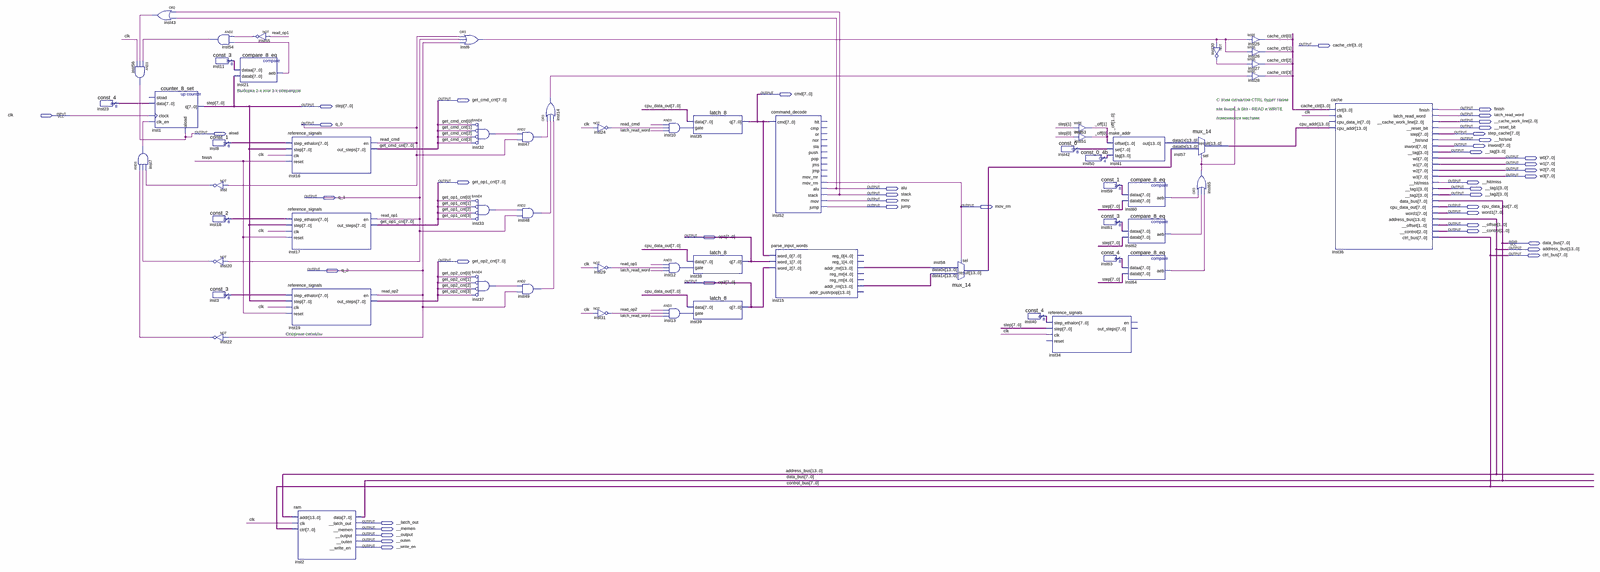
[diagram p0: schematic sheet, whole]
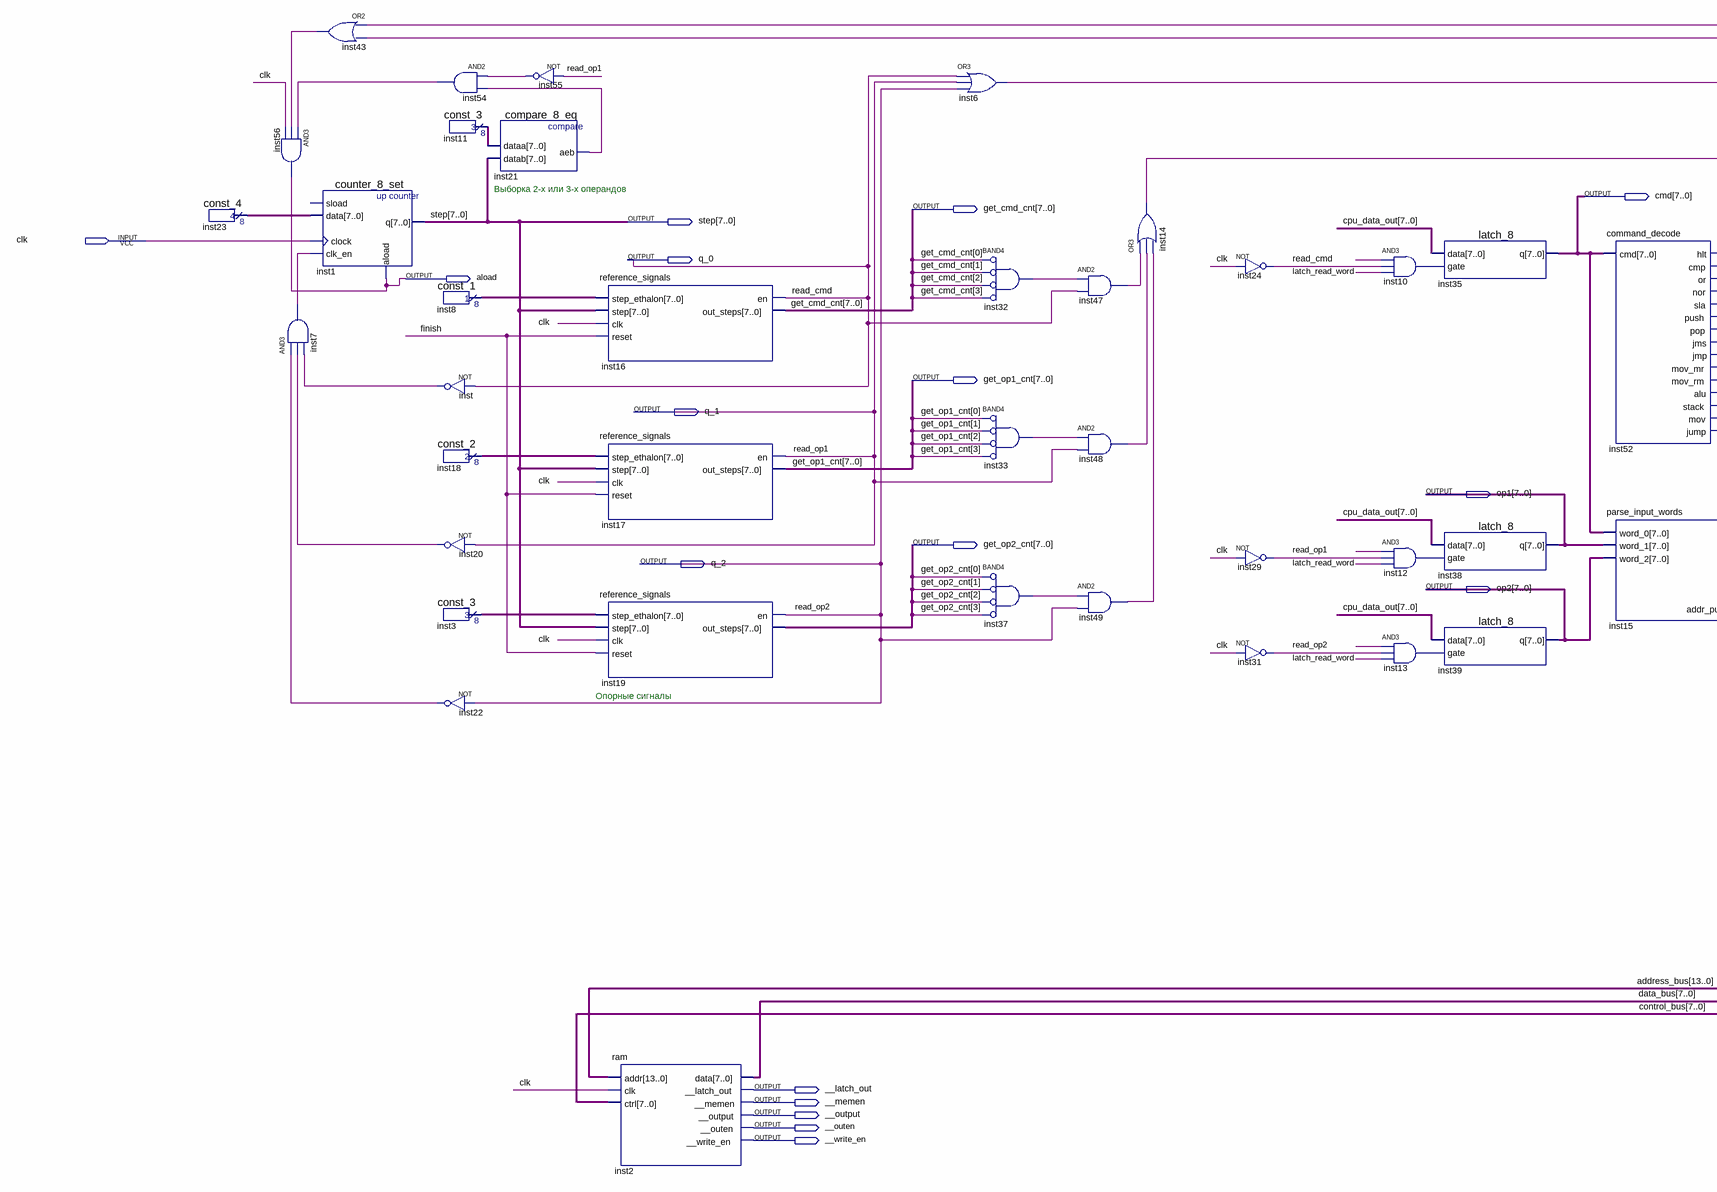
[diagram p1: schematic sheet, left part]
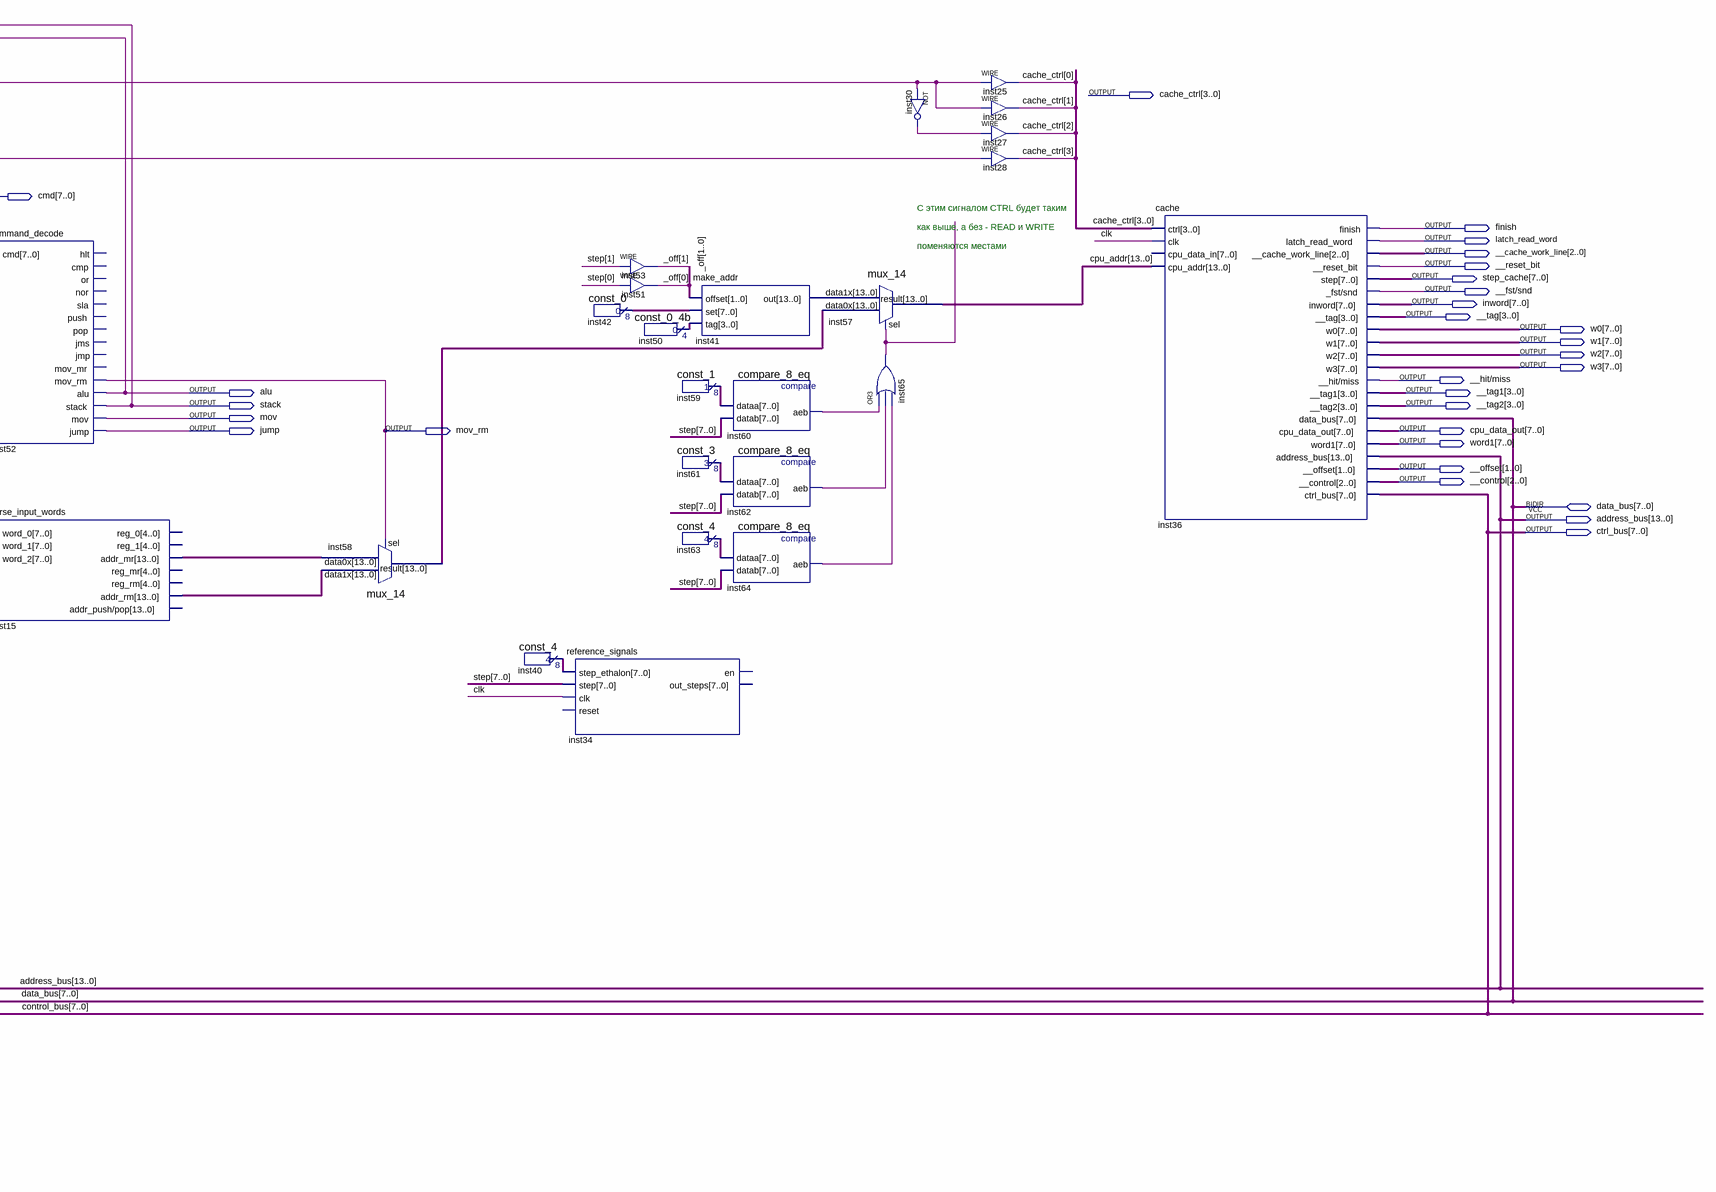
[diagram p2: schematic sheet, right part]
// Quartus schematic control_block.bdf as structural Verilog: 60 symbols, 45 pins
module control_block (
  input  clk,
  inout  [7:0] data_bus,
  output [3:0] cache_ctrl,
  output [7:0] cmd,
  output [7:0] get_cmd_cnt,
  output [7:0] step,
  output finish,
  output latch_read_word,
  output [2:0] __cache_work_line,
  output q_0,
  output __reset_bit,
  output aload,
  output [7:0] step_cache,
  output \__fst/snd ,
  output [7:0] inword,
  output [3:0] __tag,
  output [7:0] w0,
  output [7:0] w1,
  output [7:0] w2,
  output [7:0] w3,
  output [7:0] get_op1_cnt,
  output \__hit/miss ,
  output alu,
  output [3:0] __tag1,
  output stack,
  output [3:0] __tag2,
  output q_1,
  output mov,
  output jump,
  output mov_rm,
  output [7:0] cpu_data_out,
  output [7:0] word1,
  output [1:0] __offset,
  output [2:0] __control,
  output [7:0] op1,
  output [13:0] address_bus,
  output [7:0] ctrl_bus,
  output [7:0] get_op2_cnt,
  output q_2,
  output [7:0] op2,
  output __latch_out,
  output __memen,
  output __output,
  output __outen,
  output __write_en
);

  wire inst6_out, inst7_out, inst10_out, inst12_out, inst13_out, inst14_out, inst20_out, inst21_aeb,
       inst22_out, inst24_out, inst29_out, inst30_out, inst31_out, inst32_out, inst33_out, inst37_out,
       inst43_out, inst47_out, inst48_out, inst49_out, inst54_out, inst55_out, inst60_aeb, inst62_aeb,
       inst64_aeb, inst65_out, inst_out;
  wire [1:0] _off;
  wire [3:0] inst50_result;
  wire [7:0] inst3_result, inst8_result, inst11_result, inst18_result, inst23_result, inst40_result,
       inst42_result, inst59_result, inst61_result, inst63_result;
  wire [13:0] cpu_addr, inst15_addr_mr, inst15_addr_rm, inst41_out, inst58_result;

  const_4 inst23 (.result(inst23_result));
  and inst56 (aload, inst54_out, inst43_out, clk);
  or inst43 (inst43_out, stack, alu);
  counter_8_set inst1 (.data(inst23_result), .clock(clk), .clk_en(inst7_out), .aload(aload), .q(step));  // open: sload
  and inst7 (inst7_out, inst22_out, inst20_out, inst_out);
  and inst54 (inst54_out, inst55_out, inst21_aeb);
  const_3 inst11 (.result(inst11_result));
  const_1 inst8 (.result(inst8_result));
  not inst (inst_out, q_0);
  const_2 inst18 (.result(inst18_result));
  not inst20 (inst20_out, q_1);
  const_3 inst3 (.result(inst3_result));
  not inst22 (inst22_out, q_2);
  not inst55 (inst55_out, q_1);
  compare_8_eq inst21 (.dataa(inst11_result), .datab(step), .aeb(inst21_aeb));
  reference_signals inst16 (
    .step_ethalon(inst8_result), .step(step), .clk(clk), .reset(finish), .en(q_0), .out_steps(get_cmd_cnt));
  reference_signals inst17 (
    .step_ethalon(inst18_result), .step(step), .clk(clk), .reset(finish), .en(q_1), .out_steps(get_op1_cnt));
  reference_signals inst19 (
    .step_ethalon(inst3_result), .step(step), .clk(clk), .reset(finish), .en(q_2), .out_steps(get_op2_cnt));
  ram inst2 (
    .addr(address_bus), .clk(clk), .ctrl(ctrl_bus), .__latch_out(__latch_out), .__memen(__memen),
    .__output(__output), .__outen(__outen), .__write_en(__write_en), .data(data_bus));
  or inst6 (inst6_out, q_0, q_1, q_2);
  and inst32 (inst32_out, ~get_cmd_cnt[0], ~get_cmd_cnt[1], ~get_cmd_cnt[2], ~get_cmd_cnt[3]);  // BAND4
  and inst33 (inst33_out, ~get_op1_cnt[0], ~get_op1_cnt[1], ~get_op1_cnt[2], ~get_op1_cnt[3]);  // BAND4
  and inst37 (inst37_out, ~get_op2_cnt[0], ~get_op2_cnt[1], ~get_op2_cnt[2], ~get_op2_cnt[3]);  // BAND4
  and inst47 (inst47_out, inst32_out, q_0);
  and inst48 (inst48_out, inst33_out, q_1);
  and inst49 (inst49_out, inst37_out, q_2);
  or inst14 (inst14_out, inst47_out, inst48_out, inst49_out);
  not inst24 (inst24_out, clk);
  not inst29 (inst29_out, clk);
  not inst31 (inst31_out, clk);
  and inst10 (inst10_out, q_0, inst24_out, latch_read_word);
  and inst12 (inst12_out, q_1, inst29_out, latch_read_word);
  and inst13 (inst13_out, q_2, inst31_out, latch_read_word);
  latch_8 inst35 (.data(cpu_data_out), .gate(inst10_out), .q(cmd));
  latch_8 inst38 (.data(cpu_data_out), .gate(inst12_out), .q(op1));
  latch_8 inst39 (.data(cpu_data_out), .gate(inst13_out), .q(op2));
  command_decode inst52 (
    .cmd(cmd), .mov_rm(mov_rm), .alu(alu), .stack(stack), .mov(mov), .jump(jump));  // open: hlt, cmp, or, nor, sla, push, pop, jms, jmp, mov_mr
  parse_input_words inst15 (
    .word_0(cmd), .word_1(op1), .word_2(op2), .addr_mr(inst15_addr_mr), .addr_rm(inst15_addr_rm));  // open: reg_0, reg_1, reg_mr, reg_rm, addr_push/pop
  mux_14 inst58 (.data1x(inst15_addr_rm), .data0x(inst15_addr_mr), .sel(mov_rm), .result(inst58_result));
  const_4 inst40 (.result(inst40_result));
  const_0 inst42 (.result(inst42_result));
  reference_signals inst34 (.step_ethalon(inst40_result), .step(step), .clk(clk));  // open: reset, en, out_steps
  assign _off[1] = step[1];  // WIRE inst53
  assign _off[0] = step[0];  // WIRE inst51
  const_0_4b inst50 (.result(inst50_result));
  const_1 inst59 (.result(inst59_result));
  const_3 inst61 (.result(inst61_result));
  const_4 inst63 (.result(inst63_result));
  make_addr inst41 (.offset(_off), .set(inst42_result), .tag(inst50_result), .out(inst41_out));
  compare_8_eq inst60 (.dataa(inst59_result), .datab(step), .aeb(inst60_aeb));
  compare_8_eq inst62 (.dataa(inst61_result), .datab(step), .aeb(inst62_aeb));
  compare_8_eq inst64 (.dataa(inst63_result), .datab(step), .aeb(inst64_aeb));
  mux_14 inst57 (.data1x(inst41_out), .data0x(inst58_result), .sel(inst65_out), .result(cpu_addr));
  or inst65 (inst65_out, inst60_aeb, inst62_aeb, inst64_aeb);
  not inst30 (inst30_out, inst6_out);
  assign cache_ctrl[0] = inst6_out;  // WIRE inst25
  assign cache_ctrl[1] = inst6_out;  // WIRE inst26
  assign cache_ctrl[2] = inst30_out;  // WIRE inst27
  assign cache_ctrl[3] = inst14_out;  // WIRE inst28
  cache inst36 (
    .ctrl(cache_ctrl), .clk(clk), .cpu_addr(cpu_addr), .finish(finish), .latch_read_word(latch_read_word),
    .__cache_work_line(__cache_work_line), .__reset_bit(__reset_bit), .step(step_cache),
    .\_fst/snd (\__fst/snd ), .inword(inword), .__tag(__tag), .w0(w0), .w1(w1), .w2(w2), .w3(w3),
    .\__hit/miss (\__hit/miss ), .__tag1(__tag1), .__tag2(__tag2), .cpu_data_out(cpu_data_out),
    .word1(word1), .address_bus(address_bus), .__offset(__offset), .__control(__control),
    .ctrl_bus(ctrl_bus), .data_bus(data_bus));  // open: cpu_data_in

  // Other names for the same wires on the sheet: control_bus[7:0] = ctrl_bus; read_cmd = q_0; read_op1 = q_1;
  //   read_op2 = q_2

  // Notes on the sheet:
  //   Выборка 2-х или 3-х операндов
  //   С этим сигналом CTRL будет таким
  //   как выше, а без - READ и WRITE
  //   поменяются местами
  //   Опорные сигналы
endmodule
